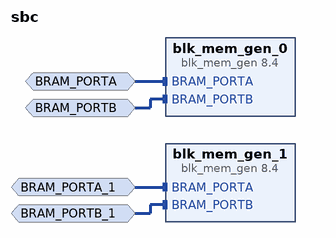
[diagram p0: block diagram of the top level]
# Vivado block design sbc, xc7z010clg400-1, Vivado 2018.2
create_bd_design sbc

create_bd_intf_port -mode Slave -vlnv xilinx.com:interface:bram_rtl:1.0 BRAM_PORTA
set_property -dict [list \
  CONFIG.MEM_SIZE 128 \
  CONFIG.MEM_WIDTH 64 \
  CONFIG.MASTER_TYPE BRAM_CTRL \
  CONFIG.READ_WRITE_MODE READ_WRITE \
] [get_bd_intf_ports BRAM_PORTA]
create_bd_intf_port -mode Slave -vlnv xilinx.com:interface:bram_rtl:1.0 BRAM_PORTB
set_property -dict [list \
  CONFIG.MEM_SIZE 128 \
  CONFIG.MEM_WIDTH 64 \
  CONFIG.MASTER_TYPE BRAM_CTRL \
  CONFIG.READ_WRITE_MODE READ_WRITE \
] [get_bd_intf_ports BRAM_PORTB]
create_bd_intf_port -mode Slave -vlnv xilinx.com:interface:bram_rtl:1.0 BRAM_PORTA_1
set_property -dict [list \
  CONFIG.MEM_SIZE 128 \
  CONFIG.MEM_WIDTH 64 \
  CONFIG.MASTER_TYPE BRAM_CTRL \
  CONFIG.READ_WRITE_MODE READ_WRITE \
] [get_bd_intf_ports BRAM_PORTA_1]
create_bd_intf_port -mode Slave -vlnv xilinx.com:interface:bram_rtl:1.0 BRAM_PORTB_1
set_property -dict [list \
  CONFIG.MEM_SIZE 128 \
  CONFIG.MEM_WIDTH 64 \
  CONFIG.MASTER_TYPE BRAM_CTRL \
  CONFIG.READ_WRITE_MODE READ_WRITE \
] [get_bd_intf_ports BRAM_PORTB_1]

create_bd_cell -type ip -vlnv xilinx.com:ip:blk_mem_gen:8.4 blk_mem_gen_0
set_property -dict [list \
  CONFIG.Memory_Type True_Dual_Port_RAM \
  CONFIG.Enable_32bit_Address false \
  CONFIG.Use_Byte_Write_Enable true \
  CONFIG.Byte_Size 8 \
  CONFIG.Assume_Synchronous_Clk false \
  CONFIG.Write_Width_A 32 \
  CONFIG.Write_Depth_A 32768 \
  CONFIG.Read_Width_A 32 \
  CONFIG.Write_Width_B 32 \
  CONFIG.Read_Width_B 32 \
  CONFIG.Enable_B Use_ENB_Pin \
  CONFIG.Register_PortA_Output_of_Memory_Primitives true \
  CONFIG.Register_PortB_Output_of_Memory_Primitives true \
  CONFIG.Load_Init_File true \
  CONFIG.Coe_File ../../../../../../input.coe \
  CONFIG.Fill_Remaining_Memory_Locations true \
  CONFIG.Remaining_Memory_Locations FFFFFFFF \
  CONFIG.Use_RSTA_Pin true \
  CONFIG.Use_RSTB_Pin true \
  CONFIG.Port_A_Write_Rate 50 \
  CONFIG.Port_B_Clock 100 \
  CONFIG.Port_B_Write_Rate 50 \
  CONFIG.Port_B_Enable_Rate 100 \
  CONFIG.use_bram_block Stand_Alone \
  CONFIG.EN_SAFETY_CKT true \
] [get_bd_cells blk_mem_gen_0]
create_bd_cell -type ip -vlnv xilinx.com:ip:blk_mem_gen:8.4 blk_mem_gen_1
set_property -dict [list \
  CONFIG.Memory_Type True_Dual_Port_RAM \
  CONFIG.Enable_32bit_Address false \
  CONFIG.Use_Byte_Write_Enable true \
  CONFIG.Byte_Size 8 \
  CONFIG.Assume_Synchronous_Clk false \
  CONFIG.Write_Width_A 32 \
  CONFIG.Write_Depth_A 32768 \
  CONFIG.Read_Width_A 32 \
  CONFIG.Write_Width_B 32 \
  CONFIG.Read_Width_B 32 \
  CONFIG.Enable_B Use_ENB_Pin \
  CONFIG.Register_PortA_Output_of_Memory_Primitives true \
  CONFIG.Register_PortB_Output_of_Memory_Primitives true \
  CONFIG.Load_Init_File true \
  CONFIG.Coe_File ../../../../../../output.coe \
  CONFIG.Fill_Remaining_Memory_Locations true \
  CONFIG.Remaining_Memory_Locations 0 \
  CONFIG.Use_RSTA_Pin true \
  CONFIG.Use_RSTB_Pin true \
  CONFIG.Port_A_Write_Rate 50 \
  CONFIG.Port_B_Clock 100 \
  CONFIG.Port_B_Write_Rate 50 \
  CONFIG.Port_B_Enable_Rate 100 \
  CONFIG.use_bram_block Stand_Alone \
  CONFIG.EN_SAFETY_CKT true \
] [get_bd_cells blk_mem_gen_1]

# ---- connections ----

connect_bd_intf_net [get_bd_intf_ports BRAM_PORTA] [get_bd_intf_pins blk_mem_gen_0/BRAM_PORTA]
connect_bd_intf_net [get_bd_intf_ports BRAM_PORTB] [get_bd_intf_pins blk_mem_gen_0/BRAM_PORTB]
connect_bd_intf_net -intf_net BRAM_PORTA_1_1 [get_bd_intf_ports BRAM_PORTA_1] [get_bd_intf_pins blk_mem_gen_1/BRAM_PORTA]
connect_bd_intf_net -intf_net BRAM_PORTB_1_1 [get_bd_intf_ports BRAM_PORTB_1] [get_bd_intf_pins blk_mem_gen_1/BRAM_PORTB]

validate_bd_design
save_bd_design
